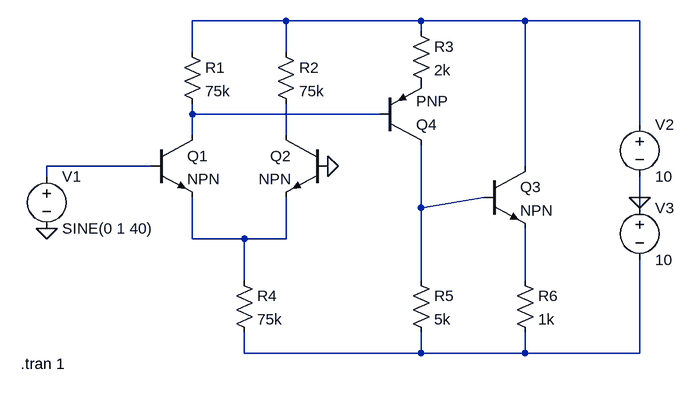
[diagram p0: schematic signal_amplifier.asc]
signal_amplifier.asc, the LTspice schematic file:
Version 4.1
SHEET 1 1016 680
WIRE 416 -112 272 -112
WIRE 624 -112 416 -112
WIRE 784 -112 624 -112
WIRE 960 -112 784 -112
WIRE 624 -96 624 -112
WIRE 272 -64 272 -112
WIRE 416 -64 416 -112
WIRE 272 32 272 16
WIRE 560 32 272 32
WIRE 960 48 960 -112
WIRE 272 64 272 32
WIRE 416 64 416 16
WIRE 208 112 48 112
WIRE 784 112 784 -112
WIRE 48 128 48 112
WIRE 960 160 960 128
WIRE 624 176 624 80
WIRE 624 176 720 160
WIRE 960 176 960 160
WIRE 272 224 272 160
WIRE 352 224 272 224
WIRE 416 224 416 160
WIRE 416 224 352 224
WIRE 352 288 352 224
WIRE 624 288 624 176
WIRE 784 288 784 208
WIRE 352 400 352 368
WIRE 624 400 624 368
WIRE 624 400 352 400
WIRE 784 400 784 368
WIRE 784 400 624 400
WIRE 960 400 960 256
WIRE 960 400 784 400
FLAG 960 160 0
FLAG 48 208 0
FLAG 480 112 0
SYMBOL voltage 48 112 R0
WINDOW 123 0 0 Left 0
WINDOW 39 0 0 Left 0
SYMATTR InstName V1
SYMATTR Value SINE(0 1 40)
SYMBOL npn 208 64 R0
SYMATTR InstName Q1
SYMBOL npn 480 64 M0
SYMATTR InstName Q2
SYMBOL npn 720 112 R0
SYMATTR InstName Q3
SYMBOL pnp 560 80 M180
SYMATTR InstName Q4
SYMBOL res 256 -80 R0
SYMATTR InstName R1
SYMATTR Value 75k
SYMBOL res 400 -80 R0
SYMATTR InstName R2
SYMATTR Value 75k
SYMBOL res 608 -112 R0
SYMATTR InstName R3
SYMATTR Value 2k
SYMBOL res 336 272 R0
SYMATTR InstName R4
SYMATTR Value 75k
SYMBOL res 608 272 R0
SYMATTR InstName R5
SYMATTR Value 5k
SYMBOL res 768 272 R0
SYMATTR InstName R6
SYMATTR Value 1k
SYMBOL voltage 960 32 R0
SYMATTR InstName V2
SYMATTR Value 10
SYMBOL voltage 960 160 R0
SYMATTR InstName V3
SYMATTR Value 10
TEXT 8 416 Left 2 !.tran 1

The netlist it stands for:
* signal_amplifier.asc
V1 N004 0 SINE(0 1 40)
Q1 N002 N004 N006 0 NPN
Q2 N003 0 N006 0 NPN
Q3 N001 N005 N007 0 NPN
Q4 N005 N002 P001 0 PNP
R1 N001 N002 75k
R2 N001 N003 75k
R3 N001 P001 2k
R4 N006 N008 75k
R5 N005 N008 5k
R6 N007 N008 1k
V2 N001 0 10
V3 0 N008 10
.model NPN NPN
.model PNP PNP
.lib standard.bjt
.tran 1
.backanno
.end